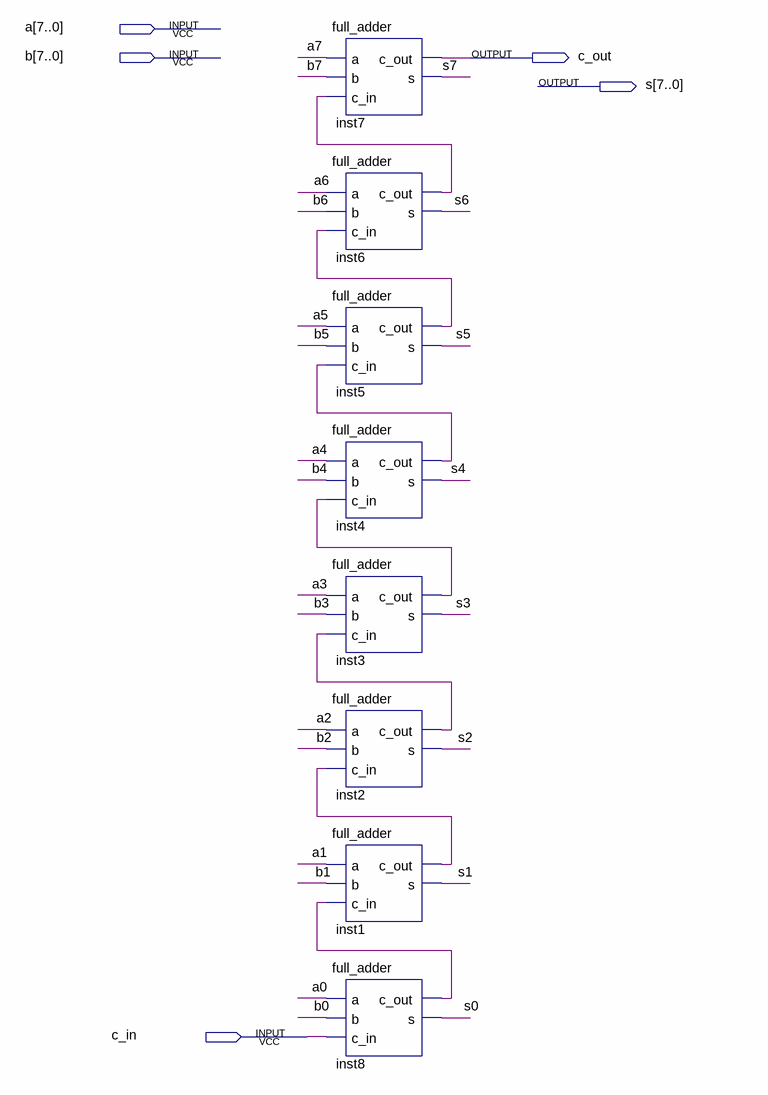
[diagram p0: schematic sheet]
// Quartus schematic 8_bits_adder.bdf as structural Verilog: 8 symbols, 5 pins
module \8_bits_adder  (
  input  [7:0] a,
  input  [7:0] b,
  input  c_in,
  output c_out,
  output [7:0] s
);

  wire inst1_c_out, inst2_c_out, inst3_c_out, inst4_c_out, inst5_c_out, inst6_c_out, inst8_c_out;

  full_adder inst7 (.a(a[7]), .b(b[7]), .c_in(inst6_c_out), .c_out(c_out), .s(s[7]));
  full_adder inst6 (.a(a[6]), .b(b[6]), .c_in(inst5_c_out), .c_out(inst6_c_out), .s(s[6]));
  full_adder inst5 (.a(a[5]), .b(b[5]), .c_in(inst4_c_out), .c_out(inst5_c_out), .s(s[5]));
  full_adder inst4 (.a(a[4]), .b(b[4]), .c_in(inst3_c_out), .c_out(inst4_c_out), .s(s[4]));
  full_adder inst3 (.a(a[3]), .b(b[3]), .c_in(inst2_c_out), .c_out(inst3_c_out), .s(s[3]));
  full_adder inst2 (.a(a[2]), .b(b[2]), .c_in(inst1_c_out), .c_out(inst2_c_out), .s(s[2]));
  full_adder inst1 (.a(a[1]), .b(b[1]), .c_in(inst8_c_out), .c_out(inst1_c_out), .s(s[1]));
  full_adder inst8 (.a(a[0]), .b(b[0]), .c_in(c_in), .c_out(inst8_c_out), .s(s[0]));
endmodule
